# EAGLE design CC2533_PCB_AD5933 (EAGLE 6.4)
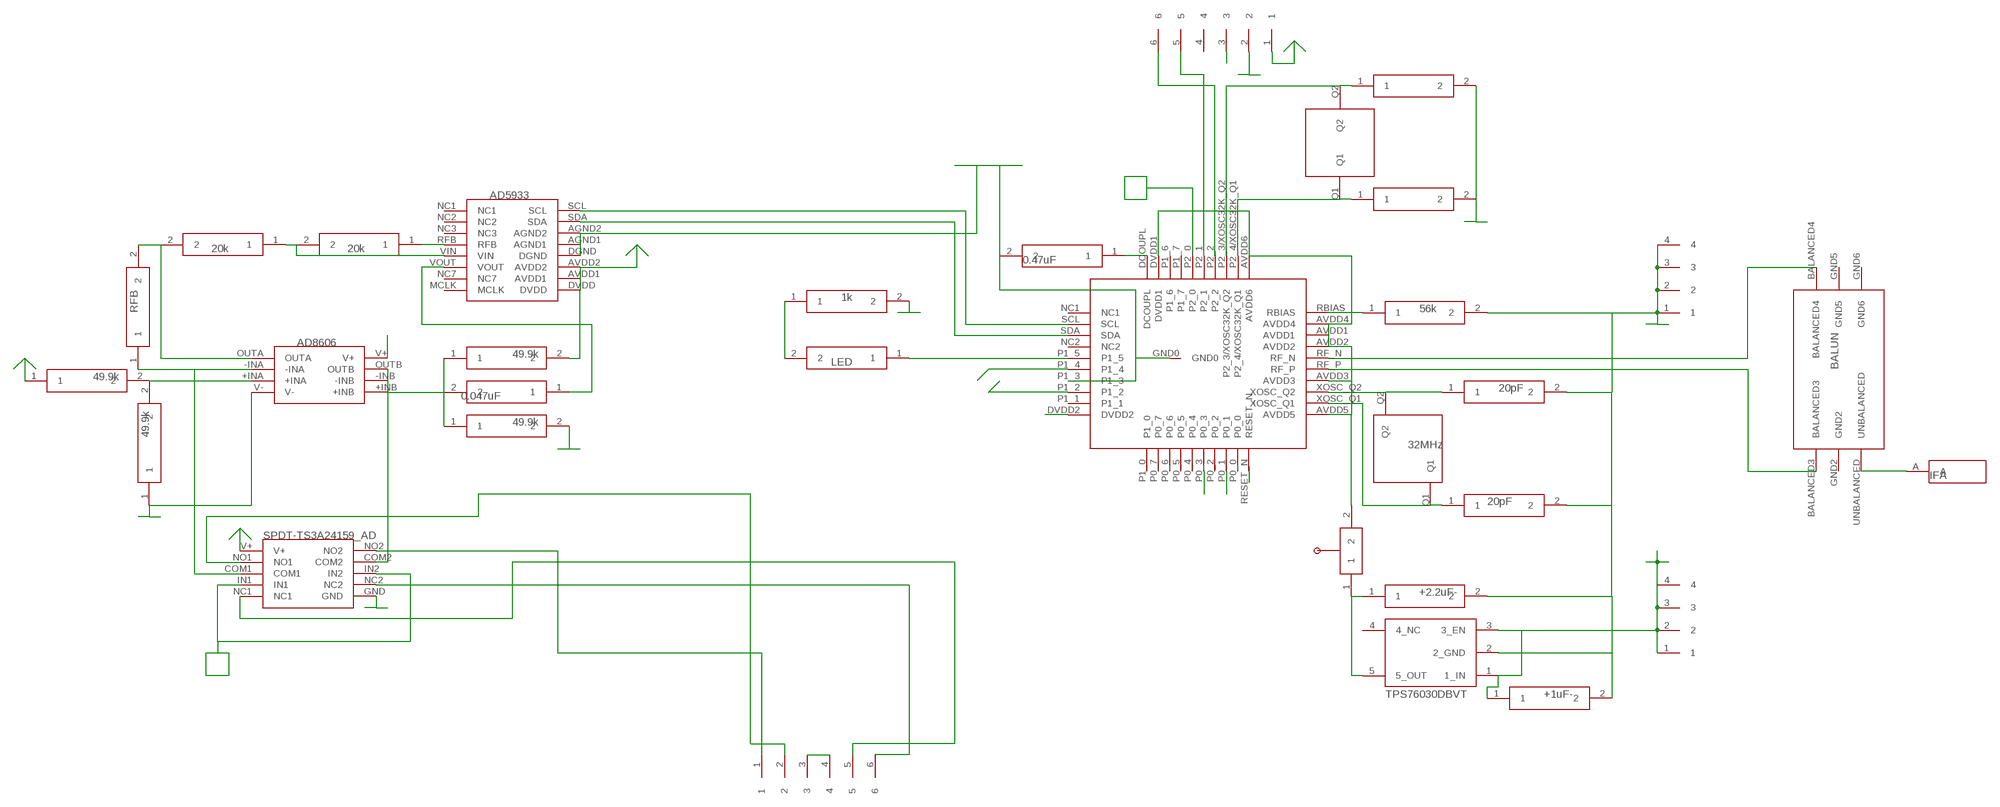
[diagram p0: schematic, sheet 1]

## Parts
U$1  CC2533  [CC2533]
U$2  BALUN  [BALUN]
U$3  X32MHZ  [X32MHZ]
U$4  0201  [0201]
U$5  0201  [0201]
U$6  ANTENNA_BOTTOM  [ANTENNA_BOTTOM]
U$7  FFC4POS  [FFC4POS]
U$8  FFC4POS  [FFC4POS]
U$9  56k  0201  [0201]
U$10  REGULATOR  [REGULATOR]
U$11  0603  [0603]
U$12  0603  [0603]
U$14  0201  [0201]
U$16  AD5933  [AD5933]
U$17  FFC6POS  [FFC6POS]
U$18  SWITCH_MANUAL  [SWITCH_MANUAL]
U$19  SPDT_DUAL  [SPDT_DUAL]
U$20  AD8606_OPAMP  [AD8606_OPAMP]
U$21  0603_RES  [0603_RES]
U$22  0603_RES  [0603_RES]
U$23  0603_RES  [0603_RES]
U$24  0201  [0201]
U$25  0201  [0201]
U$26  0402_CAP  [0402_CAP]
U$27  0201  [0201]
U$28  0201  [0201]
U$29  0603_RES  [0603_RES]
U$30  FFC6POS  [FFC6POS]
U$31  0402  [0402]
U$39  X32.768KHZ  [X32.768KHZ]
U$40  0201  [0201]
U$41  0201  [0201]

## Nets
GND: U$1.GND0 U$1.P1_3 U$4.2 U$5.2 U$8.1 U$8.2 U$8.3 U$8.4 U$9.2 U$10.2(2_GND) U$11.2 U$12.2 U$14.2 U$16.AGND1 U$16.AGND2 U$16.DGND U$17.2 U$19.GND U$20.V- U$25.1 U$28.2 U$30.3 U$30.4 U$31.2 U$40.2 U$41.2
IN2: U$1.P2_0 U$19.IN1 U$19.IN2
LEFT: U$1.P1_4
N$1: U$1.RF_N U$2.BALANCED4
N$2: U$1.RF_P U$2.BALANCED3
N$3: U$2.UNBALANCED U$6.A
N$4: U$1.XOSC_Q2 U$3.Q2 U$5.1
N$5: U$1.XOSC_Q1 U$3.Q1 U$4.1
N$6: U$16.RFB U$21.1
N$7: U$19.NO1 U$30.2
N$8: U$19.NC1 U$30.5
N$9: U$19.NO2 U$30.1
N$10: U$19.NC2 U$30.6
N$11: U$19.COM1 U$20.-INA U$23.1
N$12: U$1.RBIAS U$9.1
N$13: U$1.SCL U$16.SCL
N$14: U$1.SDA U$16.SDA
N$16: U$1.P2_4/XOSC32K_Q1 U$39.Q1 U$41.1
N$17: U$1.P2_1 U$17.5
N$18: U$1.DCOUPL U$14.1
N$19: U$16.VOUT U$26.1
N$20: U$1.P2_2 U$17.6
N$21: U$10.5(5_OUT) U$11.1 U$18.1
N$22: U$1.P2_3/XOSC32K_Q2 U$39.Q2 U$40.1
N$23: U$16.VIN U$21.2 U$22.1
N$24: U$1.P1_5 U$29.1
N$25: U$20.OUTA U$22.2 U$23.2
N$27: U$20.+INA U$24.2 U$25.2
N$28: U$20.+INB U$26.2 U$27.1 U$28.1
N$29: U$19.COM2 U$20.-INB U$20.OUTB
N$34: U$29.2 U$31.1
P0_1: U$1.P0_1
P0_3: U$1.P0_3
RESET: U$1.RESET_N U$17.3
RIGHT: U$1.P1_2
V+: U$7.1 U$7.2 U$7.3 U$7.4 U$10.1(1_IN) U$10.3(3_EN) U$12.1
VDD: U$1.AVDD1 U$1.AVDD2 U$1.AVDD3 U$1.AVDD4 U$1.AVDD5 U$1.AVDD6 U$1.DVDD1 U$1.DVDD2 U$16.AVDD1 U$16.AVDD2 U$16.DVDD U$17.1 U$18.2 U$19.V+ U$20.V+ U$24.1 U$27.2
Unconnected: U$1.P0_0 U$1.P0_2 U$1.P0_4 U$1.P0_5 U$1.P0_6 U$1.P0_7 U$1.P1_0 U$1.P1_1 U$1.P1_6 U$1.P1_7 U$10.4(4_NC) U$16.MCLK U$16.NC1 U$16.NC2 U$16.NC3 U$16.NC7 U$17.4

## Power pins joined to a net without a drawn wire
GND2: U$2.GND2
GND5: U$2.GND5
GND6: U$2.GND6
NC1: U$1.NC1
NC2: U$1.NC2

## Library data of the parts
U$1 = CC2530_PCB_TL:CC2533
U$2 = CC2530_PCB_TL:BALUN: 2.45 GHz Impedance Matched Balun-BPF: For TI CC253X, CC254X, CC257X, CC853X and CC852X Chipset family P/N 2450BM15A0002
U$3 = CC2530_PCB_TL:X32MHZ: X32MHz ABM12-32.000MHZ-B2X-T3; X: 32MHz
U$4 U$5 = CC2530_PCB_TL:0201: Package / Case 0201 (0603 Metric); CAP: 20pF
U$6 = CC2530_PCB_TL:ANTENNA_BOTTOM: Antenna for use in bottom layer of CC2530 PCB
U$7 U$8 = CC2530_PCB_TL:FFC4POS: FFC COnnector 4POS
U$9 = CC2530_PCB_TL:0201: Package / Case 0201 (0603 Metric); R_BIAS: 56k
U$10 = CC2530_PCB_TL:REGULATOR: IC REG LDO 3V 50MA SOT23-5 TPS76030DBVT
U$11 = CC2530_PCB_TL:0603: Package / Case 0603 (1608 Metric); CAP: +2.2uF-
U$12 = CC2530_PCB_TL:0603: Package / Case 0603 (1608 Metric); CAP: +1uF-
U$14 = CC2530_PCB_TL:0201: Package / Case 0201 (0603 Metric); CAP: 0.47uF
U$16 = CC2530_PCB_TL:AD5933: AD5933
U$17 U$30 = CC2530_PCB_TL:FFC6POS: FFC Connector 6POS
U$18 = CC2530_PCB_TL:SWITCH_MANUAL
U$19 = CC2530_PCB_TL:SPDT_DUAL: TS3A24159DGSR IC SWITCH DUAL SPDT 10MSOP
U$20 = CC2530_PCB_TL:AD8606_OPAMP: OPAMP AD8606ARMZ-REEL
U$21 U$22 = CC2530_PCB_TL:0603_RES; RES: 20k
U$23 U$29 = CC2530_PCB_TL:0603_RES
U$24 U$25 U$27 U$28 = CC2530_PCB_TL:0201: Package / Case 0201 (0603 Metric); RES: 49.9k
U$26 = CC2530_PCB_TL:0402_CAP; CAP: 0.047uF
U$31 = CC2530_PCB_TL:0402: Package / Case 0402 (1005 Metric); RES: 1k
U$39 = CC2530_PCB_TL:X32.768KHZ: X32.768kHz 9HT11-32.768KDZC-T
U$40 U$41 = CC2530_PCB_TL:0201: Package / Case 0201 (0603 Metric)

## Board
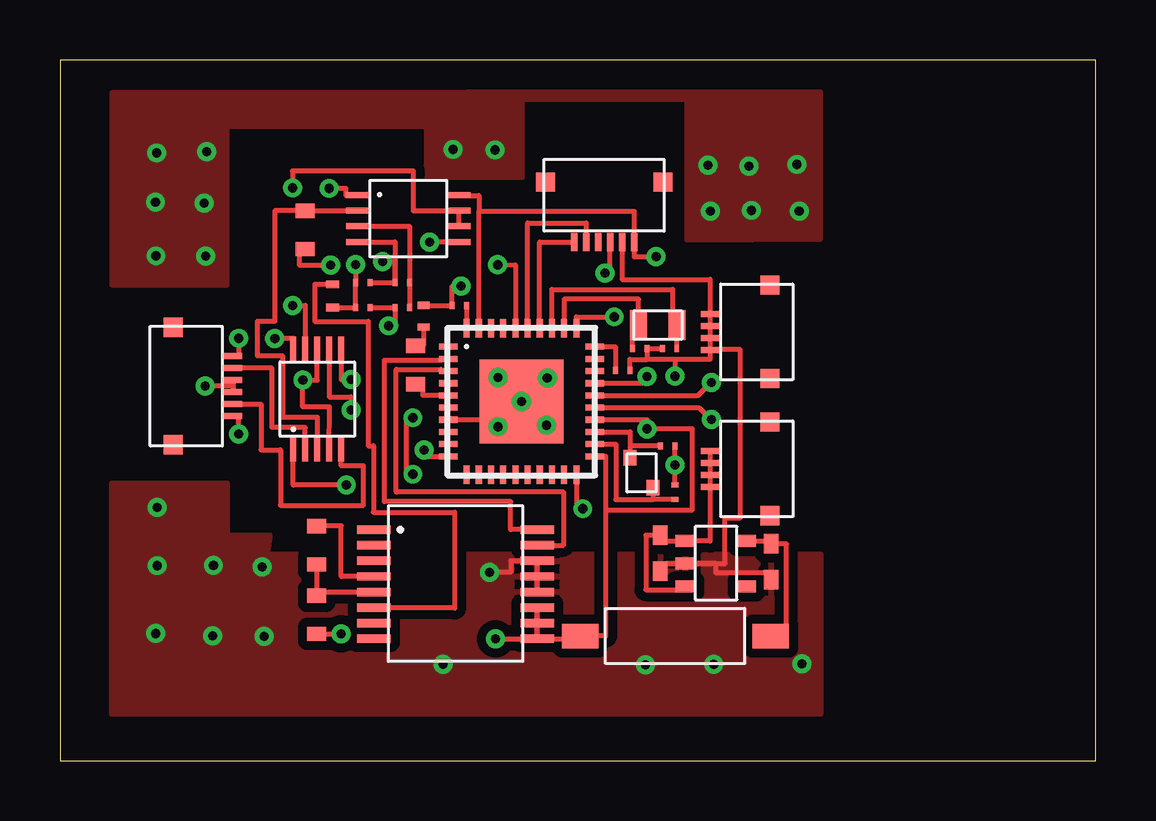
[diagram p1: board, top side]
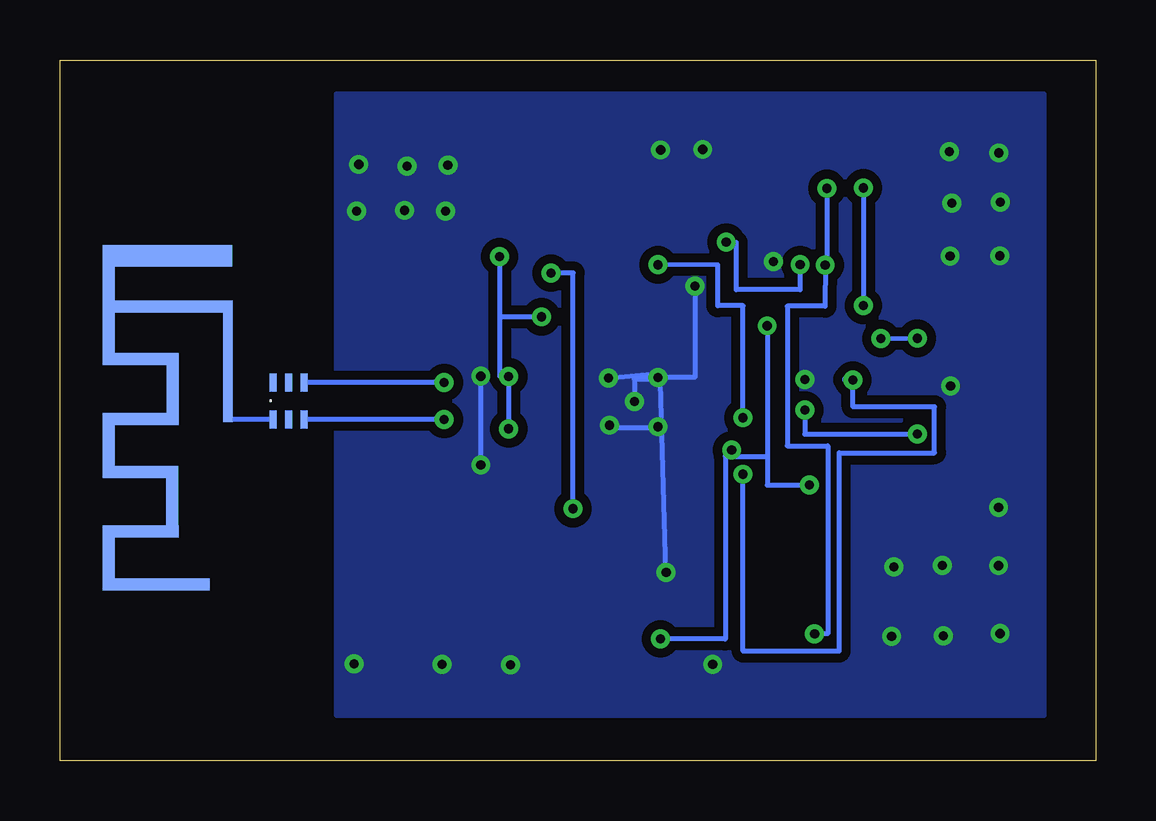
[diagram p2: board, bottom side, seen from below]

Size 43.18 x 29.21 mm. Coordinates in mm from the lower left corner, seen from the top.
Outline: 0,0 43.18,0 43.18,29.21 0,29.21 0,0
Copper layers (1*16): Top 0.035mm / dielectric 1.5mm / Bottom 0.035mm
Design rules "default *": minimum track width 8mil, minimum drill 15mil, track to track 6mil, track to pad 6mil, pad to pad 6mil, via to via 6mil, smd to smd 6mil, copper to edge 40mil, drill to drill 8mil, minimum pad ring 10mil, minimum via ring 8mil, stop-mask expansion 4mil, vias tented up to drill 0mil, thermal gap 10mil

### Footprints (pad centres in the part's own frame; a part is rotated, then mirrored left to right if it is on the bottom)
CC2533 = smd 0.762 x 0.254: AVDD1 3.048,1.27; AVDD2 3.048,0.762; AVDD3 3.048,-0.762; AVDD4 3.048,1.778; AVDD5 3.048,-2.286; DVDD2 -3.048,-2.286; NC1 -3.048,2.286; NC2 -3.048,0.762; P1_1 -3.048,-1.778; P1_2 -3.048,-1.27; P1_3 -3.048,-0.762; P1_4 -3.048,-0.254; P1_5 -3.048,0.254; RBIAS 3.048,2.286; RF_N 3.048,0.254; RF_P 3.048,-0.254; SCL -3.048,1.778; SDA -3.048,1.27; XOSC_Q1 3.048,-1.778; XOSC_Q2 3.048,-1.27 | smd 0.254 x 0.762: AVDD6 2.286,3.048; DCOUPL -2.286,3.048; DVDD1 -1.778,3.048; P0_0 1.778,-3.048; P0_1 1.27,-3.048; P0_2 0.762,-3.048; P0_3 0.254,-3.048; P0_4 -0.254,-3.048; P0_5 -0.762,-3.048; P0_6 -1.27,-3.048; P0_7 -1.778,-3.048; P1_0 -2.286,-3.048; P1_6 -1.27,3.048; P1_7 -0.762,3.048; P2_0 -0.254,3.048; P2_1 0.254,3.048; P2_2 0.762,3.048; P2_3/XOSC32K_Q2 1.27,3.048; P2_4/XOSC32K_Q1 1.778,3.048; RESET_N 2.286,-3.048 | smd 3.5 x 3.5: GND0 0,0
BALUN = smd 0.75 x 0.3: BALANCED3 -0.782,-0.655; BALANCED4 0.768,-0.655; GND2 -0.782,-0.005; GND5 0.768,-0.005; GND6 0.768,0.645; UNBALANCED -0.782,0.645
X32MHZ = smd 0.55 x 0.65: Q1 0.496,-0.576; Q2 -0.454,0.674
0201 = smd 0.203 x 0.3: 1 -0.3,-0.001; 2 0.3,-0.001
ANTENNA_BOTTOM = smd 0.203 x 0.203 bottom: A -0.014,-0.096 | smd 0.381 x 4.589 bottom: A1 -0.014,2.097 | smd 0.5 x 0.9 bottom: P$3 0.059,6.728 | smd 4.4 x 0.9 bottom: P$4 2.509,6.727 | smd 0.5 x 5 bottom: P$5 4.945,4.677 | smd 2.65 x 0.5 bottom: P$6 3.37,2.426; P$12 3.375,-2.271; P$14 3.372,-4.76 | smd 0.5 x 2 bottom: P$7 2.296,1.179; P$13 2.299,-3.512 | smd 4.4 x 0.5 bottom: P$8 2.495,4.627 | smd 0.5 x 2.7 bottom: P$9 4.948,-1.171; P$15 4.945,-5.861 | smd 3.94 x 0.5 bottom: P$10 2.725,-6.962 | smd 2.667 x 0.5 bottom: P$11 3.381,-0.071 | smd 0.5 x 0.5 bottom: P$16 0.045,4.627
FFC4POS = smd 0.762 x 0.254: 1 0.04,0.742; 2 0.04,0.242; 3 0.04,-0.258; 4 0.04,-0.758 | smd 0.8 x 0.8: P$5 -2.46,1.94; P$6 -2.46,-1.96
REGULATOR = smd 0.5 x 0.8: 1 0.94,1.275; 2 0,1.275; 3 -0.95,1.275; 4 -0.95,-1.275; 5 0.95,-1.275
0603 = smd 0.8 x 0.6: 1 -0.751,0; 2 0.749,0
AD5933 = smd 1.4 x 0.35: AGND1 3.45,0.25; AGND2 3.45,0.9; AVDD1 3.45,-1.7; AVDD2 3.45,-1.05; DGND 3.45,-0.4; DVDD 3.45,-2.35; MCLK -3.35,-2.35; NC1 -3.35,2.2; NC2 -3.35,1.55; NC3 -3.35,0.9; NC7 -3.35,-1.7; RFB -3.35,0.25; SCL 3.45,2.2; SDA 3.45,1.55; VIN -3.35,-0.4; VOUT -3.35,-1.05
FFC6POS = smd 0.762 x 0.254: 1 0.008,1.269; 2 0.008,0.769; 3 0.008,0.269; 4 0.008,-0.231; 5 0.008,-0.731; 6 0.008,-1.231 | smd 0.8 x 0.8: P$7 -2.49,2.47; P$8 -2.49,-2.43
SWITCH_MANUAL = smd 1.524 x 1.016: 1 -4.13,0; 2 3.81,0
SPDT_DUAL = smd 1.05 x 0.25: COM1 -2.075,0; COM2 2.075,0.5; GND 2.075,-1; IN1 -2.075,-0.5; IN2 2.075,0; NC1 -2.075,-1; NC2 2.075,-0.5; NO1 -2.075,0.5; NO2 2.075,1; V+ -2.075,1
AD8606_OPAMP = smd 1 x 0.25: +INA -2.1,-0.325; +INB 2.1,-0.975; -INA -2.1,0.325; -INB 2.1,-0.325; OUTA -2.1,0.975; OUTB 2.1,0.325; V+ 2.1,0.975; V- -2.1,-0.975
0603_RES = smd 0.6 x 0.8: 1 -0.8,0; 2 0.8,0
0402_CAP = smd 0.33 x 0.533: 1 -0.475,0.001; 2 0.501,0.001
0402 = smd 0.3 x 0.5: 1 -0.45,0.001; 2 0.45,0.001
X32.768KHZ = smd 1.25 x 0.7: Q1 0.009,-0.811; Q2 0.009,0.789

### Placement (x,y rotation side)
U$1  19.24,14.97 0 top
U$2  33.66,15 90 bottom
U$3  24.22,11.95 0 top
U$4  25.64,11.19 90 top
U$5  25.33,13.12 0 top
U$6  36.2,14.31 0 top
U$7  27.14,12.15 180 top
U$8  27.14,17.87 180 top
U$9  23.45,16.27 0 top
U$10  27.34,8.21 90 top
U$11  29.65,8.29 270 top
U$12  25.03,8.65 270 top
U$14  16.65,18.97 180 top
U$16  16.44,7.43 0 top
U$17  22.67,21.63 270 top
U$18  25.49,5.2 180 top
U$19  10.72,15.07 90 top
U$20  14.52,22.6 0 top
U$21  10.7,8.98 270 top
U$22  10.7,6.08 270 top
U$23  10.22,22.12 270 top
U$24  14.27,18.88 0 top
U$25  14.27,19.93 0 top
U$26  11.36,19.38 270 top
U$27  12.63,18.88 0 top
U$28  12.63,19.93 0 top
U$29  14.83,16.49 90 top
U$30  7.2,15.6 0 top
U$31  15.15,18.53 90 top
U$39  24.93,18.17 270 top
U$40  25.41,17.18 180 top
U$41  24.17,17.18 0 top

### Tracks (layer width: path | path; a pad name or v marks a point on that pad's centre or on a via)
GND  (via drill 0.38 pad 0.64)
  Top 0.203: U$4.2 v25.64,12.33 U$5.2 25.64,13.06 | U$9.2 23.75,16.72 24.47,16.72 | U$40.2 24.57,17.18 U$41.2 24.47,16.72 | U$8.1 U$8.2 U$8.3 U$8.4 27.1,20.06 23.44,20.06 U$17.2 | U$8.1 27.1,16.72 25.64,16.72 | 25.64,16.72 24.47,16.72 | U$12.2 25.16,8.21 U$10.2 | U$11.2 29.65,7.83 27.34,7.83 27.34,8.21 U$10.2 | U$16.AGND1 U$16.AGND2 18.8,8.33 18.8,7.85 v17.91,7.85 | U$16.AGND1 U$16.DGND | 20.33,7.68 U$16.AGND1 | U$30.4 U$30.3 7.21,15.62 v6.05,15.62 | 25.64,16.72 v25.64,16.02 | U$10.2 27.72,8.21 27.72,10.12 28.36,10.12 28.36,17.14 27.1,17.14 U$8.1 | U$1.GND0 20.02,14.97 20.02,16.02 20.37,16.02 20.37,16.18 20.22,16.18 v20.32,15.96 | v18.26,15.98 18.19,16.11 v18.26,13.92 | v20.27,13.98 20.44,13.82 20.44,13.84 17.64,13.84 17.64,14.21 U$1.P1_3 | U$14.2 | U$14.2 16.35,19.78 v16.71,19.78 | U$28.2 U$25.1 | U$19.GND 11.72,15.88 v12.13,15.88 | U$31.2 U$14.2 | U$14.2 | U$20.V- 13.97,21.62 U$25.1 | U$25.1 13.97,20.8 v13.45,20.8
  Bottom 0.203: v25.64,16.02 25.64,12.39 v25.64,12.33 | v17.91,7.85 18.15,15.77 18.37,15.89 19.24,15.89 U$1.GND0 | v20.32,15.96 18.31,16.14 v18.26,15.98 16.71,15.98 v16.71,19.78 | v18.26,13.92 v18.27,13.91 18.27,13.87 20.2,13.87 v20.27,13.98
  other vias: 19.24,14.97 16.39,25.48 30.82,22.91 27.11,22.91 28.82,22.94 6.08,21.03 4,21.04 4.05,10.56 6.4,8.14 8.42,8.07 30.92,4.03 27.01,24.83 28.72,24.79 30.72,24.85 18.14,25.46 6,23.24 6.11,25.38 4.04,25.34 3.98,23.28 4.05,8.13 3.99,5.3 6.36,5.2 8.51,5.17 27.25,4.02 24.4,3.99 15.97,4.02
  pour Bottom (isolate 0.381): 2.15,27.79 31.67,27.8 31.67,1.89 2.15,1.87
  pour Top (isolate 0.381): 2.15,19.83 6.97,19.83 6.97,26.45 15.25,26.45 15.25,24.32 19.29,24.32 19.29,27.58 26.12,27.58 26.12,21.71 31.71,21.75 31.71,27.88 2.15,27.84
  pour Top (isolate 0.381): 2.15,11.57 6.97,11.57 6.97,9.41 8.75,9.41 8.64,8.63 30.86,8.63 30.97,8.62 31.71,8.62 31.71,1.93 2.15,1.93
IN2  (via drill 0.38 pad 0.64)
  Top 0.203: U$19.IN1 11.23,14.75 10.12,14.75 v10.12,15.87 10.72,15.87 U$19.IN2 | v14.71,11.94 14.45,11.94 14.45,14.29 v14.71,14.29 | v18.25,20.67 18.98,20.66 U$1.P2_0
  Bottom 0.203: 10.47,15.92 10.47,15.87 v10.12,15.87 | v10.12,15.87 10.12,14.75 6.73,14.75 6.73,12.83 10.69,12.83 10.69,4.57 14.71,4.57 v14.71,11.94 | v10.12,15.87 | v14.71,14.29 14.71,18.97 15.76,18.97 15.76,20.66 v18.25,20.67
LEFT
  Top 0.203: U$1.P1_4
N$1  (via drill 0.38 pad 0.64)
  Top 0.203: U$1.RF_N 26.6,15.22 27.14,15.76 v27.16,15.76
  Bottom 0.203: v27.16,15.76 U$2.BALANCED4
N$2  (via drill 0.38 pad 0.64)
  Top 0.203: U$1.RF_P 26.63,14.72 27.13,14.21 v27.16,14.21
  Bottom 0.203: v27.16,14.21 U$2.BALANCED3
N$3
  Bottom 0.203: U$2.UNBALANCED U$6.A | U$6.A
N$4
  Top 0.203: U$1.XOSC_Q2 23.76,13.7 U$3.Q2 23.76,13.12 U$5.1
N$5
  Top 0.203: U$1.XOSC_Q1 23.18,13.19 23.18,10.88 24.71,10.88 | U$4.1 24.71,10.88 | U$3.Q1 24.71,10.88
N$6
  Top 0.203: U$16.RFB 11.72,7.68 11.72,9.78 U$21.1
N$7
  Top 0.203: U$19.NO1 10.22,13.88 8.84,13.89 8.84,16.36 U$30.2
N$8
  Top 0.203: U$30.5 8.38,14.86 8.38,12.95 9.19,12.95 9.19,10.64 12.65,10.64 12.65,12.29 11.72,12.29 U$19.NC1
N$9  (via drill 0.38 pad 0.64)
  Top 0.203: U$19.NO2 9.72,17.6 v8.96,17.6 | v7.44,17.61 7.44,16.85 U$30.1
  Bottom 0.203: v8.96,17.6 v7.44,17.61
N$10  (via drill 0.38 pad 0.64)
  Top 0.203: v7.45,13.62 7.44,14.38 U$30.6 | U$19.NC2 11.22,15.17 12.13,15.17 v12.13,14.62
  Bottom 0.203: v12.13,14.62 12.13,13.61 v7.45,13.62
N$11
  Top 0.203: U$20.-INA 10.07,22.92 U$23.1 8.96,22.92 8.96,18.31 8.22,18.31 8.22,16.88 9.27,16.88 9.27,14.31 10.72,14.31 U$19.COM1
N$12
  Top 0.203: U$1.RBIAS 23.15,17.26 U$9.1
N$13
  Top 0.203: U$1.SCL 15.9,16.75 15.9,16.68 13.53,16.68 13.53,10.8 18.79,10.8 18.79,9.63 U$16.SCL 20.33,9.64
N$14
  Top 0.203: U$1.SDA 15.94,16.23 15.88,16.31 14.01,16.31 14.01,11.2 20.98,11.2 20.98,8.98 U$16.SDA
N$16
  Top 0.203: U$41.1 23.87,18.16 U$39.Q1 24.12,19.24 21.02,19.24 U$1.P2_4/XOSC32K_Q1
N$17
  Top 0.203: U$1.P2_1 19.49,22.41 21.93,22.41 U$17.5
N$18
  Top 0.203: U$14.1 U$1.DCOUPL
N$19
  Top 0.203: U$16.VOUT 13.53,6.37 16.45,6.37 16.45,10.35 13.07,10.35 13.07,13.12 12.85,13.12 12.85,18.31 10.62,18.31 10.62,19.86 U$26.1
N$20
  Top 0.203: U$1.P2_2 20,21.62 U$17.6
N$21
  Top 0.203: U$10.5 29.65,9.16 U$11.1 29.65,9.03 30.29,9.03 30.29,5.22 29.62,5.22 U$18.1
N$22
  Top 0.203: U$40.1 U$39.Q2 | U$1.P2_3/XOSC32K_Q2 20.51,19.64 25.54,19.64 25.54,18.16 U$39.Q2 | U$39.Q2
N$23
  Top 0.203: U$16.VIN 10.7,7.03 U$22.1 U$21.2
N$24
  Top 0.203: U$1.P1_5 15.13,15.23 15.13,15.7 U$29.1
N$25  (via drill 0.38 pad 0.64)
  Top 0.203: U$22.2 v11.72,5.28 | 9.97,21.32 U$23.2 9.97,21.32 9.97,20.66 v11.28,20.66 | v11.22,23.86 11.91,23.86 11.91,23.57 U$20.OUTA
  Bottom 0.203: v11.22,23.86 11.22,20.66 v11.28,20.66 11.29,18.98 11.29,18.94 12.86,18.94 12.86,13.12 11.18,13.12 11.18,5.28 v11.72,5.28
N$27
  Top 0.203: U$24.2 U$25.2 14.57,22.27 U$20.+INA
N$28  (via drill 0.38 pad 0.64)
  Top 0.203: U$26.2 U$27.1 U$28.1 v12.33,20.68 | U$20.+INB 16.69,21.62 v15.41,21.62 v15.41,21.61
  Bottom 0.203: v12.33,20.68 12.33,19.63 15,19.63 15,21.32 15,21.61 v15.41,21.61
N$29  (via drill 0.38 pad 0.64)
  Top 0.203: U$20.-INB U$20.OUTB 14.74,22.92 14.74,24.58 9.69,24.58 v9.69,23.88 | v9.69,18.97 10.22,18.97 U$19.COM2
  Bottom 0.203: v9.69,23.88 v9.69,18.97
N$34
  Top 0.203: U$31.1 15.15,17.3 U$29.2
P0_1
  Top 0.203: 20.53,11.92 U$1.P0_1
RESET  (via drill 0.38 pad 0.64)
  Top 0.203: U$17.3 22.92,21.62 22.92,20.33 v22.72,20.33 | U$1.RESET_N 21.52,10.5 v21.79,10.5
  Bottom 0.203: v21.79,10.5 21.79,20.33 v22.72,20.33
V+
  Top 0.203: U$10.3 26.07,7.12 24.42,7.12 24.42,9.4 U$12.1 25.16,9.15 U$10.1 27.1,9.15 U$7.1 U$7.2 U$7.3 U$7.4
VDD  (via drill 0.38 pad 0.64)
  Top 0.203: U$1.AVDD4 U$1.AVDD1 U$1.AVDD2 24.48,15.73 v24.48,16.02 | U$16.DVDD U$16.AVDD1 U$16.AVDD2 U$16.DVDD | U$16.DVDD 21.68,5.08 U$18.2 22.75,5.2 22.75,10.46 | U$1.DVDD1 17.46,22.91 | 17.46,22.91 17.46,23.56 16.62,23.56 U$20.V+ | 17.46,22.91 23.94,22.91 U$17.1 23.94,21.01 v24.85,21.01 | U$27.2 U$24.1 13.97,18.12 v13.7,18.12 | v15.18,12.95 15.18,12.69 U$1.DVDD2 | v11.94,11.49 9.72,11.49 U$19.V+ | U$1.AVDD3 24.48,14.21 v24.48,13.83 26.36,13.83 26.36,10.46 22.75,10.46 | U$1.AVDD6 21.52,18.5 v23.1,18.5 | U$1.AVDD5 22.75,12.69 22.75,10.46 | v18.15,5.07 U$16.DVDD
  Bottom 0.203: v13.7,18.12 13.7,12.69 | 13.7,12.69 13.7,11.49 v11.94,11.49 | v24.48,13.83 v24.48,16.02 24.85,16.02 24.85,18.5 | v24.85,21.01 24.85,18.5 | v23.1,18.5 24.85,18.5 | 15.18,12.69 15.44,12.69 15.44,5.07 v18.15,5.07 | v15.18,12.95 15.18,12.69 | 15.18,12.69 13.7,12.69